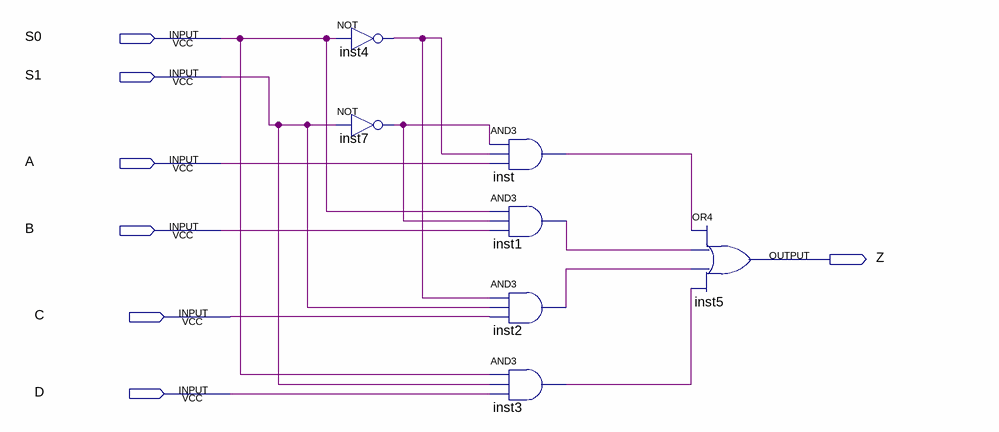
[diagram p0: schematic sheet]
// Quartus schematic MUX_4to1.bdf as structural Verilog: 7 symbols, 7 pins
module MUX_4to1 (
  input  S0,
  input  S1,
  input  A,
  input  B,
  input  C,
  input  D,
  output Z
);

  wire inst1_out, inst2_out, inst3_out, inst4_out, inst7_out, inst_out;

  not inst4 (inst4_out, S0);
  not inst7 (inst7_out, S1);
  and inst (inst_out, inst7_out, inst4_out, A);
  and inst1 (inst1_out, S0, inst7_out, B);
  and inst2 (inst2_out, inst4_out, S1, C);
  and inst3 (inst3_out, S0, S1, D);
  or inst5 (Z, inst_out, inst1_out, inst2_out, inst3_out);
endmodule
